# Altium schematic sheet WiCAN_master.SchDoc
size A4; SheetNumber: 1; SheetTotal: 6
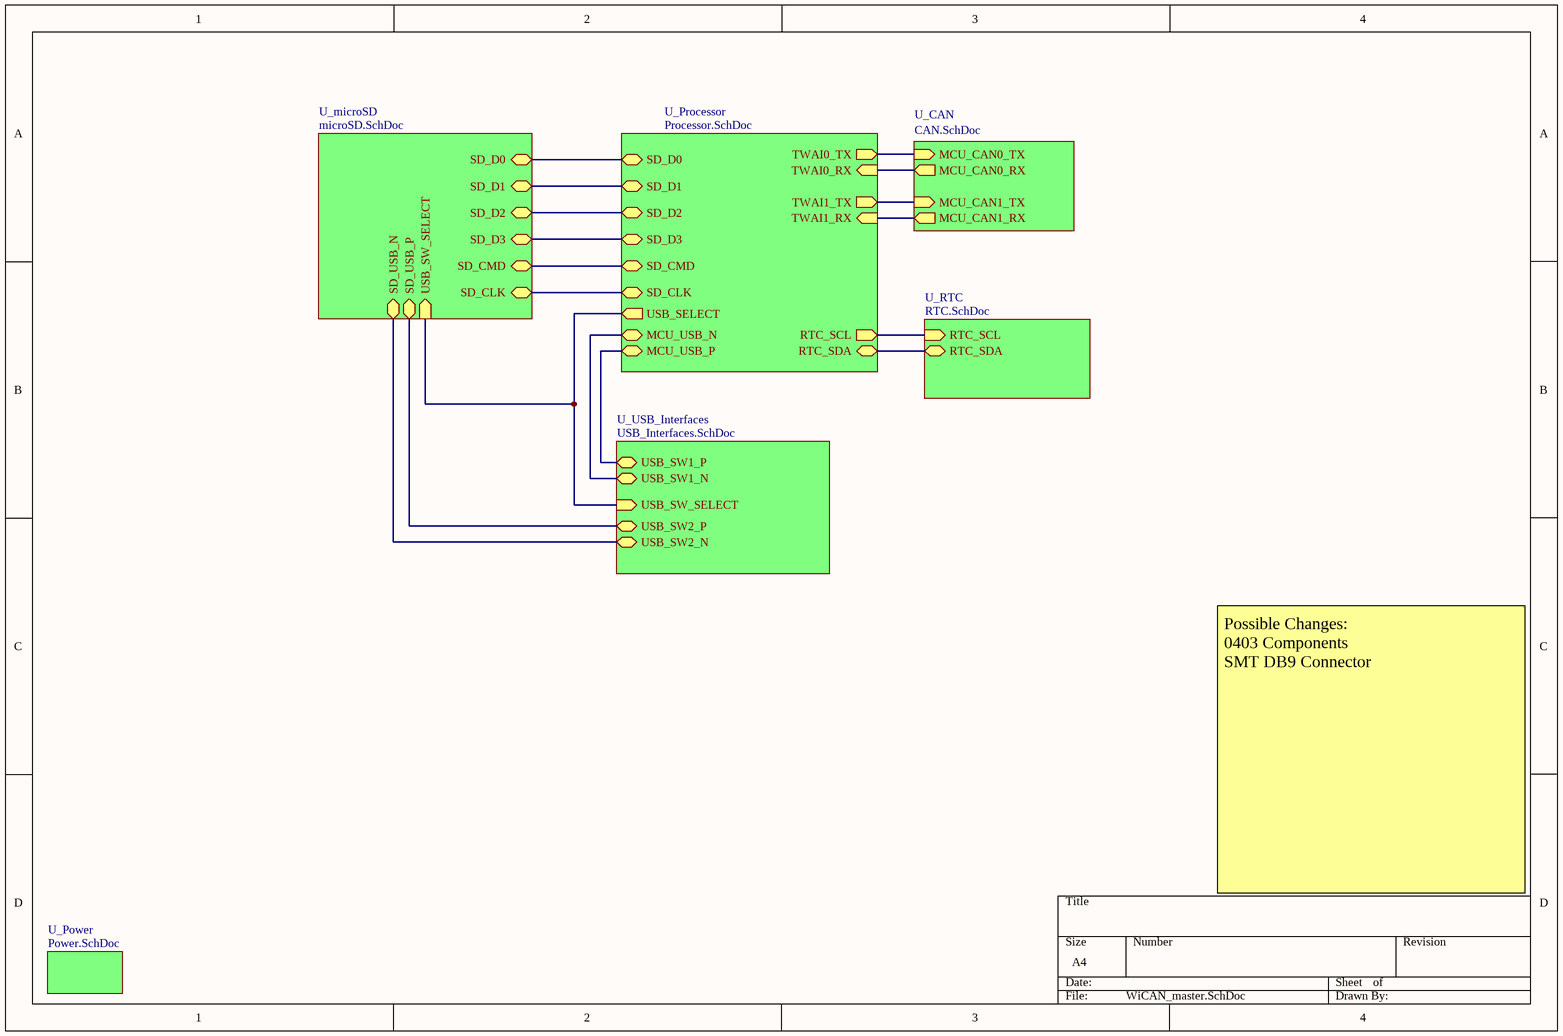
[diagram p0: WiCAN_master.SchDoc]

## Sub-sheets
U_CAN = CAN.SchDoc: MCU_CAN0_TX (in), MCU_CAN0_RX (out), MCU_CAN1_TX (in), MCU_CAN1_RX (out)
U_microSD = microSD.SchDoc: SD_D0 (bidir), SD_D1 (bidir), SD_D2 (bidir), SD_D3 (bidir), SD_CMD (bidir), SD_CLK (bidir), SD_USB_P (bidir), SD_USB_N (bidir), USB_SW_SELECT (in)
U_Power = Power.SchDoc: no entries
U_Processor = Processor.SchDoc: SD_D0 (bidir), SD_D1 (bidir), SD_D2 (bidir), SD_D3 (bidir), SD_CMD (bidir), SD_CLK (bidir), RTC_SDA (bidir), TWAI0_TX (out), TWAI0_RX (in), TWAI1_TX (out), TWAI1_RX (in), MCU_USB_N (bidir), MCU_USB_P (bidir), USB_SELECT (out), RTC_SCL (out)
U_RTC = RTC.SchDoc: RTC_SCL (in), RTC_SDA (bidir)
U_USB_Interfaces = USB_Interfaces.SchDoc: USB_SW2_P (bidir), USB_SW2_N (bidir), USB_SW1_P (bidir), USB_SW1_N (bidir), USB_SW_SELECT (in)

## Nets
(unnamed): sheet U_Processor/SD_D0, sheet U_microSD/SD_D0
(unnamed): sheet U_Processor/SD_D1, sheet U_microSD/SD_D1
(unnamed): sheet U_Processor/SD_D2, sheet U_microSD/SD_D2
(unnamed): sheet U_Processor/SD_D3, sheet U_microSD/SD_D3
(unnamed): sheet U_Processor/SD_CMD, sheet U_microSD/SD_CMD
(unnamed): sheet U_Processor/SD_CLK, sheet U_microSD/SD_CLK
(unnamed): sheet U_Processor/RTC_SDA, sheet U_RTC/RTC_SDA
(unnamed): sheet U_Processor/TWAI0_TX, sheet U_CAN/MCU_CAN0_TX
(unnamed): sheet U_Processor/TWAI0_RX, sheet U_CAN/MCU_CAN0_RX
(unnamed): sheet U_Processor/TWAI1_TX, sheet U_CAN/MCU_CAN1_TX
(unnamed): sheet U_Processor/TWAI1_RX, sheet U_CAN/MCU_CAN1_RX
(unnamed): sheet U_Processor/MCU_USB_N, sheet U_USB_Interfaces/USB_SW1_N
(unnamed): sheet U_Processor/MCU_USB_P, sheet U_USB_Interfaces/USB_SW1_P
(unnamed): sheet U_Processor/USB_SELECT, sheet U_microSD/USB_SW_SELECT, sheet U_USB_Interfaces/USB_SW_SELECT
(unnamed): sheet U_Processor/RTC_SCL, sheet U_RTC/RTC_SCL
(unnamed): sheet U_microSD/SD_USB_P, sheet U_USB_Interfaces/USB_SW2_P
(unnamed): sheet U_microSD/SD_USB_N, sheet U_USB_Interfaces/USB_SW2_N

## Notes on the sheet
- Possible Changes:
  0403 Components
  SMT DB9 Connector